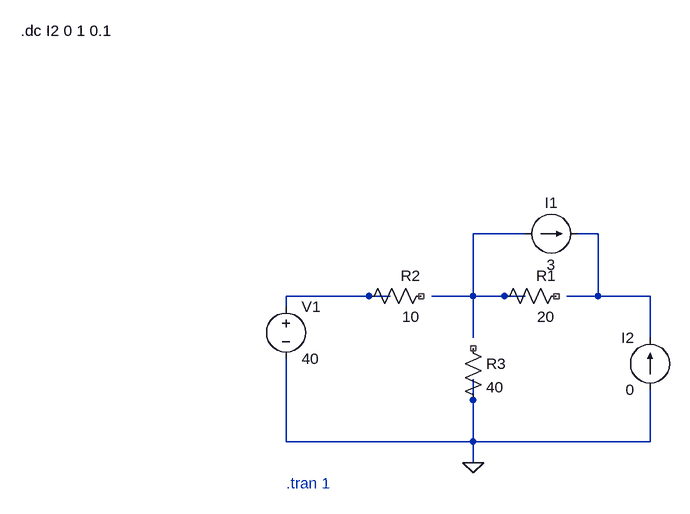
[diagram p0: schematic Ex_04_76.asc]
Ex_04_76.asc, the LTspice schematic file:
Version 4.1
SHEET 1 880 680
WIRE 352 32 272 32
WIRE 464 32 432 32
WIRE 144 128 -16 128
WIRE 272 128 272 32
WIRE 272 128 208 128
WIRE 352 128 272 128
WIRE 464 128 464 32
WIRE 464 128 416 128
WIRE 544 128 464 128
WIRE -16 144 -16 128
WIRE 272 192 272 128
WIRE 544 192 544 128
WIRE -16 352 -16 224
WIRE 272 352 272 256
WIRE 272 352 -16 352
WIRE 544 352 544 272
WIRE 544 352 272 352
WIRE 272 384 272 352
FLAG 272 384 0
SYMBOL voltage -16 128 R0
WINDOW 123 0 0 Left 0
WINDOW 39 0 0 Left 0
SYMATTR InstName V1
SYMATTR Value 40
SYMBOL current 352 32 R270
WINDOW 0 32 40 VTop 2
WINDOW 3 -32 40 VBottom 2
WINDOW 123 0 0 Left 0
WINDOW 39 0 0 Left 0
SYMATTR InstName I1
SYMATTR Value 3
SYMBOL res 416 112 R90
WINDOW 0 0 32 VBottom 2
WINDOW 3 32 32 VTop 2
SYMATTR InstName R1
SYMATTR Value 20
SYMBOL res 208 112 R90
WINDOW 0 0 32 VBottom 2
WINDOW 3 32 32 VTop 2
SYMATTR InstName R2
SYMATTR Value 10
SYMBOL res 256 192 R0
SYMATTR InstName R3
SYMATTR Value 40
SYMBOL current 544 272 R180
WINDOW 0 24 80 Left 2
WINDOW 3 24 0 Left 2
WINDOW 123 0 0 Left 0
WINDOW 39 0 0 Left 0
SYMATTR InstName I2
SYMATTR Value 0
TEXT -16 416 Left 2 ;.tran 1
TEXT -424 -280 Left 2 !.dc I2 0 1 0.1

The netlist it stands for:
* Ex_04_76.asc
V1 N003 0 40
I1 N001 N002 3
R1 NC_01 N001 20
R2 NC_02 N003 10
R3 NC_03 0 40
I2 0 N002 0
* .tran 1
.dc I2 0 1 0.1
.backanno
.end